# EAGLE schematic exixe_pogo (EAGLE 8.3.2)
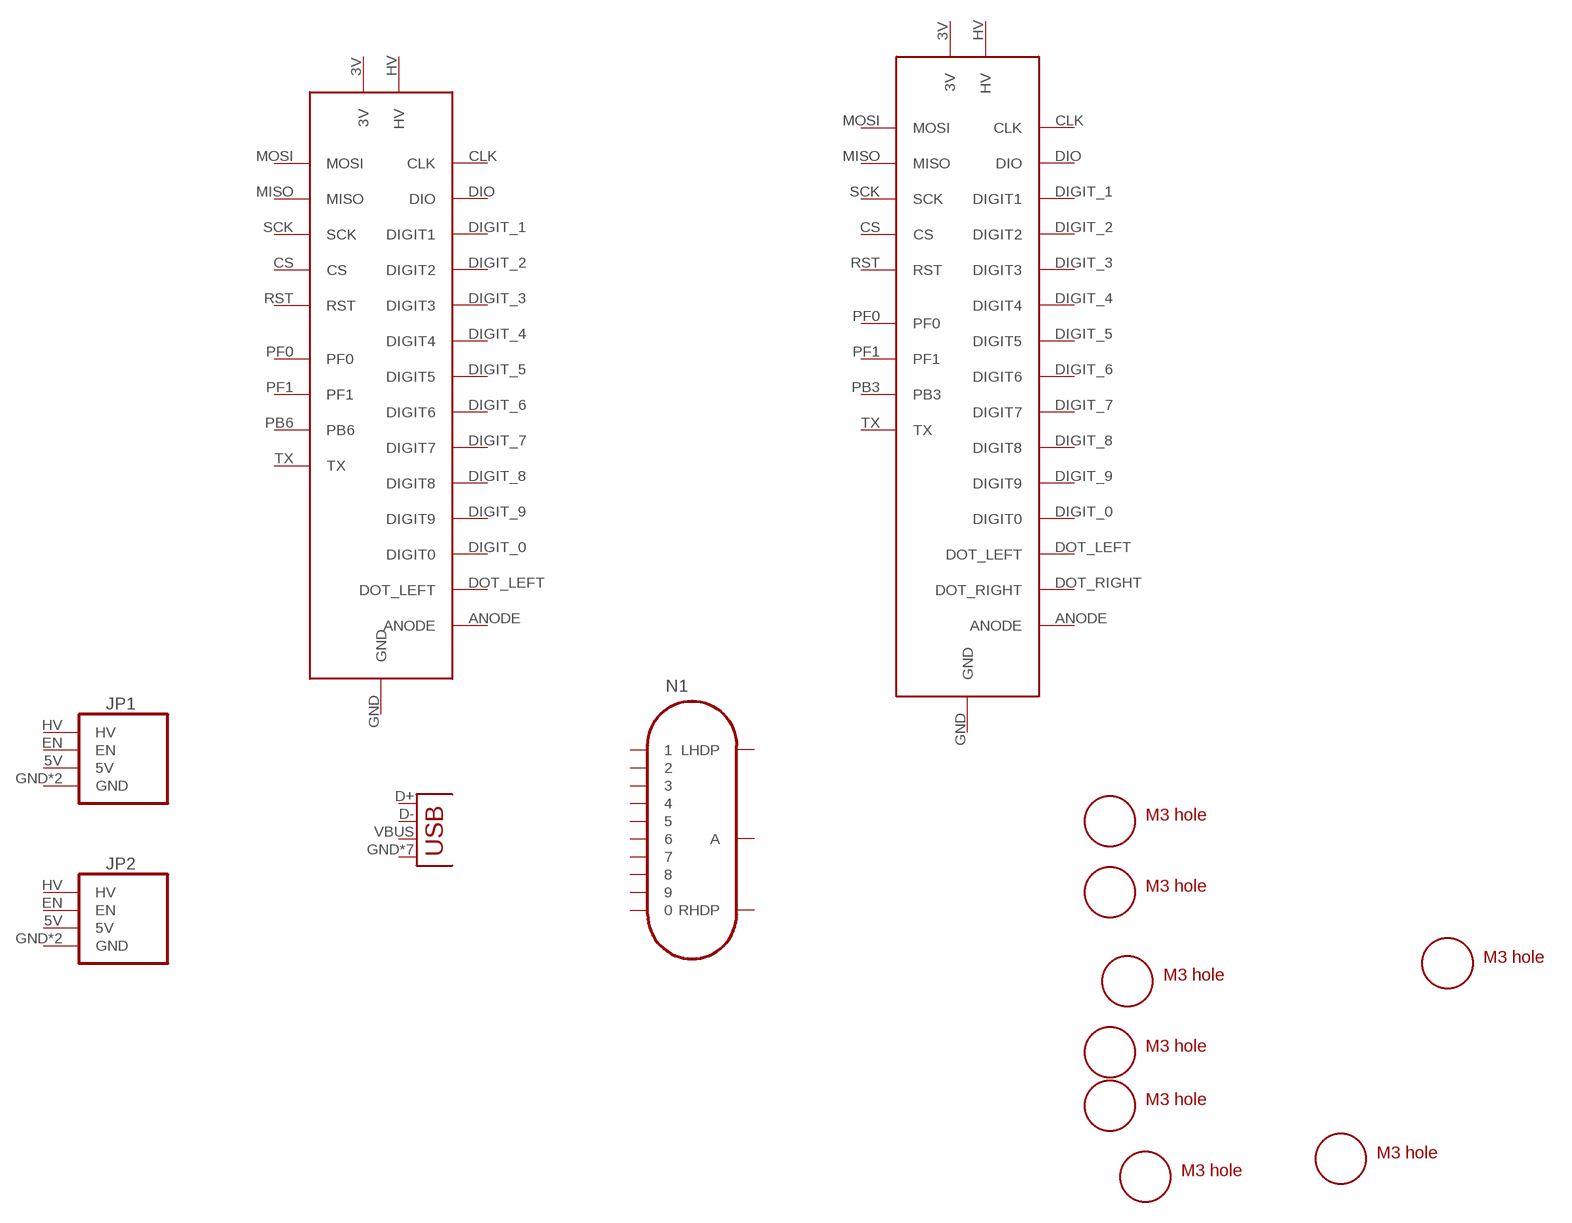
[diagram p0: schematic, sheet 1]

## Parts
JP1  EBAY_MODULEEBAY  [EBAY_PKG]
JP2  EBAY_MODULETAOBAO  [TAOBAO_PKG]
N1  IN-14  [IN-14]
U$1  EXIXE12_POGO  [EXIXE12_PAC]
U$2  EXIXE14_POGO  [EXIXE14_PAC]
U$3  M3_MOUNTING_HOLE  [M3_MOUNTING_HOLE_PACK]
U$4  M3_MOUNTING_HOLE  [M3_MOUNTING_HOLE_PACK]
U$5  M3_MOUNTING_HOLE  [M3_MOUNTING_HOLE_PACK]
U$6  M3_MOUNTING_HOLE  [M3_MOUNTING_HOLE_PACK]
U$7  M3_MOUNTING_HOLE  [M3_MOUNTING_HOLE_PACK]
U$8  M3_MOUNTING_HOLE  [M3_MOUNTING_HOLE_PACK]
U$9  M3_MOUNTING_HOLE  [M3_MOUNTING_HOLE_PACK]
U$10  M3_MOUNTING_HOLE  [M3_MOUNTING_HOLE_PACK]
X1  USB-MICROB  [USB-MICROB]
Unconnected: JP1.5V JP1.EN JP1.GND JP1.GND2(GND) JP1.HV JP2.5V JP2.EN JP2.GND JP2.GND2(GND) JP2.HV N1.0 N1.1 N1.2 N1.3 N1.4 N1.5 N1.6 N1.7 N1.8 N1.9 N1.A N1.LHDP N1.RHDP U$1.3V U$1.ANODE U$1.CLK U$1.CS U$1.DIGIT_0(DIGIT0) U$1.DIGIT_1(DIGIT1) U$1.DIGIT_2(DIGIT2) U$1.DIGIT_3(DIGIT3) U$1.DIGIT_4(DIGIT4) U$1.DIGIT_5(DIGIT5) U$1.DIGIT_6(DIGIT6) U$1.DIGIT_7(DIGIT7) U$1.DIGIT_8(DIGIT8) U$1.DIGIT_9(DIGIT9) U$1.DIO U$1.DOT_LEFT U$1.GND U$1.HV U$1.MISO U$1.MOSI U$1.PB6 U$1.PF0 U$1.PF1 U$1.RST U$1.SCK U$1.TX U$2.3V U$2.ANODE U$2.CLK U$2.CS U$2.DIGIT_0(DIGIT0) U$2.DIGIT_1(DIGIT1) U$2.DIGIT_2(DIGIT2) U$2.DIGIT_3(DIGIT3) U$2.DIGIT_4(DIGIT4) U$2.DIGIT_5(DIGIT5) U$2.DIGIT_6(DIGIT6) U$2.DIGIT_7(DIGIT7) U$2.DIGIT_8(DIGIT8) U$2.DIGIT_9(DIGIT9) U$2.DIO U$2.DOT_LEFT U$2.DOT_RIGHT U$2.GND U$2.HV U$2.MISO U$2.MOSI U$2.PB3 U$2.PF0 U$2.PF1 U$2.RST U$2.SCK U$2.TX X1.D+ X1.D- X1.GND X1.P1(GND) X1.P2(GND) X1.P3(GND) X1.P4(GND) X1.P5(GND) X1.P6(GND) X1.VBUS

## Library data of the parts
JP1 JP2 = clock:EBAY_MODULE: PIN HEADER
N1 = exixe14:IN-14: IN-14: medium numeric frontview nixie tube
U$1 = exixe_module:EXIXE12_POGO
U$2 = exixe_module:EXIXE14_POGO
U$3-U$10 = clock:M3_MOUNTING_HOLE
X1 = clock:USB: USB Connectors USB-B-PTH is fully proven SKU : PRT-00139/CONN-08278 USB-miniB is fully proven SKU : PRT-00587 USB-A-PCB is untested. USB-A-H is throughly reviewed, but untested. Spark Fun Electronics SKU : PRT-00437 USB-B-SMT is throughly reviewed, but untested. Needs silkscreen touching up. USB-A-S has not been used/tested USB-MB-H has not been used/tested USB-MICROB has been used. CONN-09505; PROD_ID: CONN-09505